# EasyEDA schematic MCU4Insole.json
TITLE: Sheet_1; REV: 1.0; Date: 2023-08-09; Sheet: 1/1; Company: Your Company
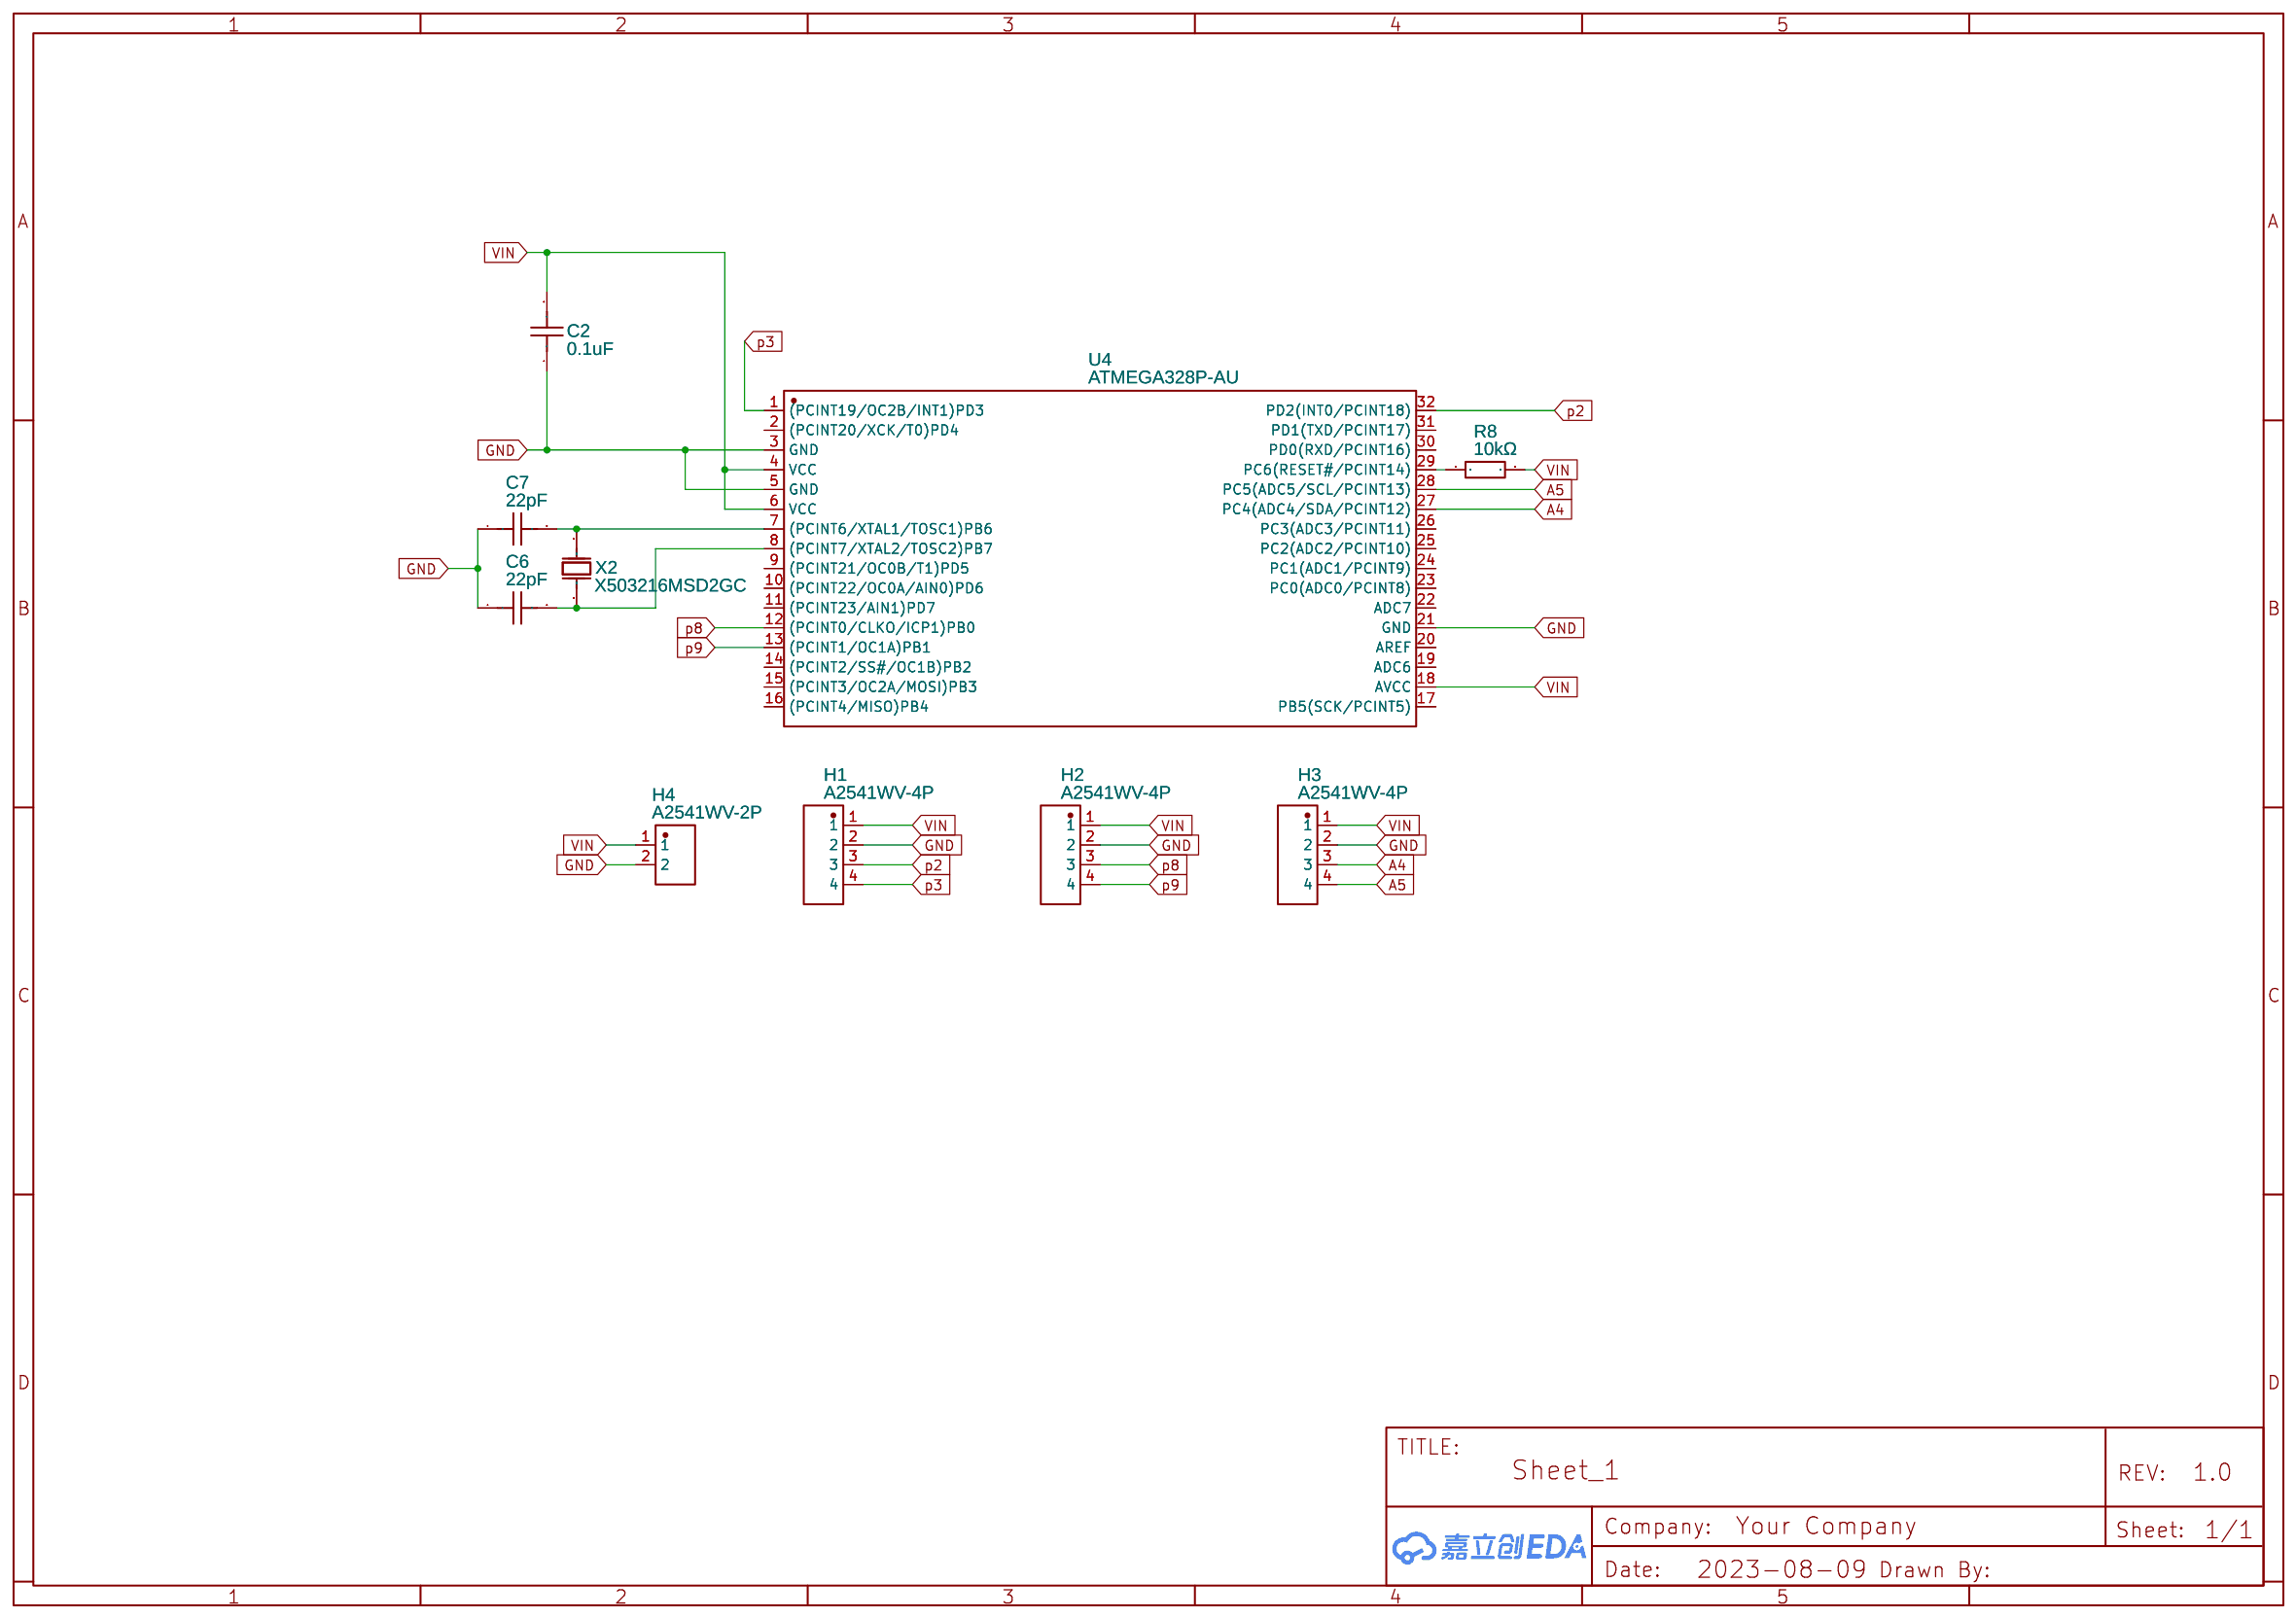
[diagram p0: schematic sheet]

## Parts
C2  0.1uF  [C0603]
C6  22pF  [C0603]
C7  22pF  [C0603]
H1  A2541WV-4P  [HDR-TH_4P-P2.54-V-M]
H2  A2541WV-4P  [HDR-TH_4P-P2.54-V-M]
H3  A2541WV-4P  [HDR-TH_4P-P2.54-V-M]
H4  A2541WV-2P  [HDR-TH_P2.54-H-M_A2541WV-2P]
R8  10kΩ  [R0603]
U4  ATMEGA328P-AU  [TQFP-32_L7.0-W7.0-P0.80-LS9.0-BL]
X2  X503216MSD2GC  [OSC-SMD_L5.0-W3.2]

## Library data of the parts
C2 = 0603BB104K500NGT: Supplier: LCSC; Supplier Part: C2168571; Manufacturer: Knowles(楼氏); Contributor: LCSC; JLCPCB Part Class: Extended Part
C6 C7 = C0603C220J5GACAUTO: Supplier: LCSC; Supplier Part: C599692; Manufacturer: KEMET(基美); Contributor: LCSC; JLCPCB Part Class: Extended Part
H1-H3 = A2541WV-4P: Contributor: LCSC; Supplier: LCSC; Supplier Part: C225479; Manufacturer: CJT(长江连接器); JLCPCB Part Class: Extended Part
H4 = A2541WV-2P: Contributor: LCSC; Supplier: LCSC; Supplier Part: C225477; Manufacturer: CJT(长江连接器); JLCPCB Part Class: Extended Part
R8 = ETCR0603F10K0K9: Supplier: LCSC; Supplier Part: C365375; Manufacturer: RESI(开步睿思）; Resistance (Ohms): 10K; Contributor: LCSC; JLCPCB Part Class: Extended Part
U4 = ATMEGA328P-AU: Supplier: LCSC; Manufacturer: MICROCHIP(美国微芯); Supplier Part: C14877; JLCPCB Part Class: Basic Part
X2 = X503216MSD2GC: Supplier Part: C49231; Supplier: LCSC; Manufacturer: YXC; JLCPCB Part Class: Extended Part

## Nets
GND: C2.1 C6.1 C7.1 H1.2 H2.2 H3.2 H4.2 U4.3(GND) U4.5(GND) U4.21(GND)
VIN: C2.2 H1.1 H2.1 H3.1 H4.1 R8.2 U4.4(VCC) U4.6(VCC) U4.18(AVCC)
A4: H3.3 U4.27(PC4(ADC4/SDA/PCINT12))
A5: H3.4 U4.28(PC5(ADC5/SCL/PCINT13))
p2: H1.3 U4.32(PD2(INT0/PCINT18))
p3: H1.4 U4.1((PCINT19/OC2B/INT1)PD3)
p8: H2.3 U4.12((PCINT0/CLKO/ICP1)PB0)
p9: H2.4 U4.13((PCINT1/OC1A)PB1)
Net-(C6-2): C6.2 U4.8((PCINT7/XTAL2/TOSC2)PB7) X2.2(OSC2)
Net-(C7-2): C7.2 U4.7((PCINT6/XTAL1/TOSC1)PB6) X2.1(OSC1)
Net-(R8-1): R8.1 U4.29(PC6(RESET#/PCINT14))

Not connected (* = marked no-connect by the designer): U4 2((PCINT20/XCK/T0)PD4) 9((PCINT21/OC0B/T1)PD5) 10((PCINT22/OC0A/AIN0)PD6) 11((PCINT23/AIN1)PD7) 14((PCINT2/SS#/OC1B)PB2) 15((PCINT3/OC2A/MOSI)PB3) 16((PCINT4/MISO)PB4) 17(PB5(SCK/PCINT5)) 19(ADC6) 20(AREF) 22(ADC7) 23(PC0(ADC0/PCINT8)) 24(PC1(ADC1/PCINT9)) 25(PC2(ADC2/PCINT10)) 26(PC3(ADC3/PCINT11)) 30(PD0(RXD/PCINT16)) 31(PD1(TXD/PCINT17))
